# Altium schematic sheet mcu0_to_mcu1_isolated_SPI.SchDoc: foxBMS BMS-Master
size A3; DocumentNumber: 12; SheetNumber: 12; SheetTotal: 24; Author: Fraunhofer IISB foxBMS Team; REL-DATE: 2017-05-16; VERSION: 1.0.2; SheetDescription: Isolated Bidirectional Interface MCU0/MCU1
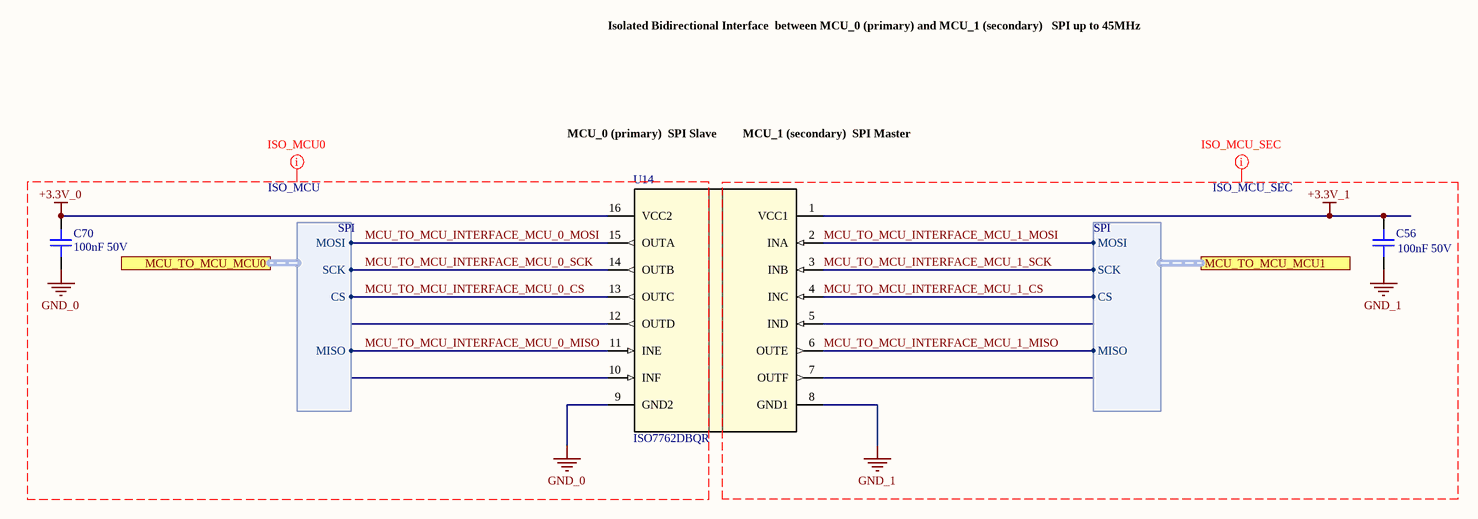
[diagram p0: mcu0_to_mcu1_isolated_SPI.SchDoc]

## Parts
C56  100nF 50V  [0603C]
C70  100nF 50V  [0603C]
U14  ISO7762DBQR  [DBQ0016A_N]

## Ports
MCU_TO_MCU_MCU0 (harness SPI), MCU_TO_MCU_MCU1 (harness SPI)

## Harnesses
SPI: CS, MISO, MOSI, SCK

## Nets
+3.3V_0: C70.2 U14.16(VCC2)
+3.3V_1: C56.1 U14.1(VCC1)
GND_0: C70.1 U14.9(GND2)
GND_1: C56.2 U14.8(GND1)
MCU_TO_MCU_INTERFACE_MCU_0_CS: U14.13(OUTC) ; port MCU_TO_MCU_MCU0.CS
MCU_TO_MCU_INTERFACE_MCU_0_MISO: U14.11(INE) ; port MCU_TO_MCU_MCU0.MISO
MCU_TO_MCU_INTERFACE_MCU_0_MOSI: U14.15(OUTA) ; port MCU_TO_MCU_MCU0.MOSI
MCU_TO_MCU_INTERFACE_MCU_0_SCK: U14.14(OUTB) ; port MCU_TO_MCU_MCU0.SCK
MCU_TO_MCU_INTERFACE_MCU_1_CS: U14.4(INC) ; port MCU_TO_MCU_MCU1.CS
MCU_TO_MCU_INTERFACE_MCU_1_MISO: U14.6(OUTE) ; port MCU_TO_MCU_MCU1.MISO
MCU_TO_MCU_INTERFACE_MCU_1_MOSI: U14.2(INA) ; port MCU_TO_MCU_MCU1.MOSI
MCU_TO_MCU_INTERFACE_MCU_1_SCK: U14.3(INB) ; port MCU_TO_MCU_MCU1.SCK

Not connected (* = marked no-connect by the designer): U14 5(IND) 7(OUTF) 10(INF) 12(OUTD)

## Layout directives
net class ISO_MCU_SEC: +3.3V_1, GND_1, MCU_TO_MCU_INTERFACE_MCU_1_CS, MCU_TO_MCU_INTERFACE_MCU_1_MISO, MCU_TO_MCU_INTERFACE_MCU_1_MOSI, MCU_TO_MCU_INTERFACE_MCU_1_SCK
net class ISO_MCU: +3.3V_0, GND_0, MCU_TO_MCU_INTERFACE_MCU_0_CS, MCU_TO_MCU_INTERFACE_MCU_0_MISO, MCU_TO_MCU_INTERFACE_MCU_0_MOSI, MCU_TO_MCU_INTERFACE_MCU_0_SCK

## Notes on the sheet
- Isolated Bidirectional Interface
  between MCU_0 (primary) and MCU_1 (secondary)
  SPI up to 45MHz
- MCU_0 (primary)
  SPI Slave
- MCU_1 (secondary)
  SPI Master
- Fraunhofer IISB
- Schottkystr. 10
- developed by:
- 91058 Erlangen
- Germany
- Author
- Project
- License
- Description
- File
- Version
- Release Date
- Sheet
- www.foxbms.org
- www.iisb.fraunhofer.de
- foxBMS Team
- /

## Library data of the parts
C56 C70 = gen_C_ceramic_100n_50V_X7R_0603: Ceramic, 100nF, ±10%, 50V, X7R, –55 to 125°C, 0603 (1608),RoHS, Automotive; Part Number: GCJ188R71H104KA12; Manufacturer: Murata; Capacitance: 100n; Case EIA: 0603; Case Metric: 1608; PnP Package: C_0603_10; PnP Value: 100nF/50V/X7R; PnP equipped: x; Automotive Qualified: True; Rated Voltage: 50V; Dielectric: X7R; Supplier 1: Digi-Key; Supplier Part Number 1: 490-5798-1-ND; Height - Seated (Max): 0.8mm; Mounting Type: SurfaceMount,MLCC; Operating Temperature: –55 to 125°C; Series: GCJ; Tolerance: ±10%; Manufacturer_Part_Number: GCJ188R71H104KA12
U14 = ISO7762DBQR: Imported; Manufacturer: Texas Instruments; PartNumber: ISO7760DBQR; RefDes: RefDes; TYPE: TYPE; Value: Value